# Altium project Gym_rep_counter.PrjPcb
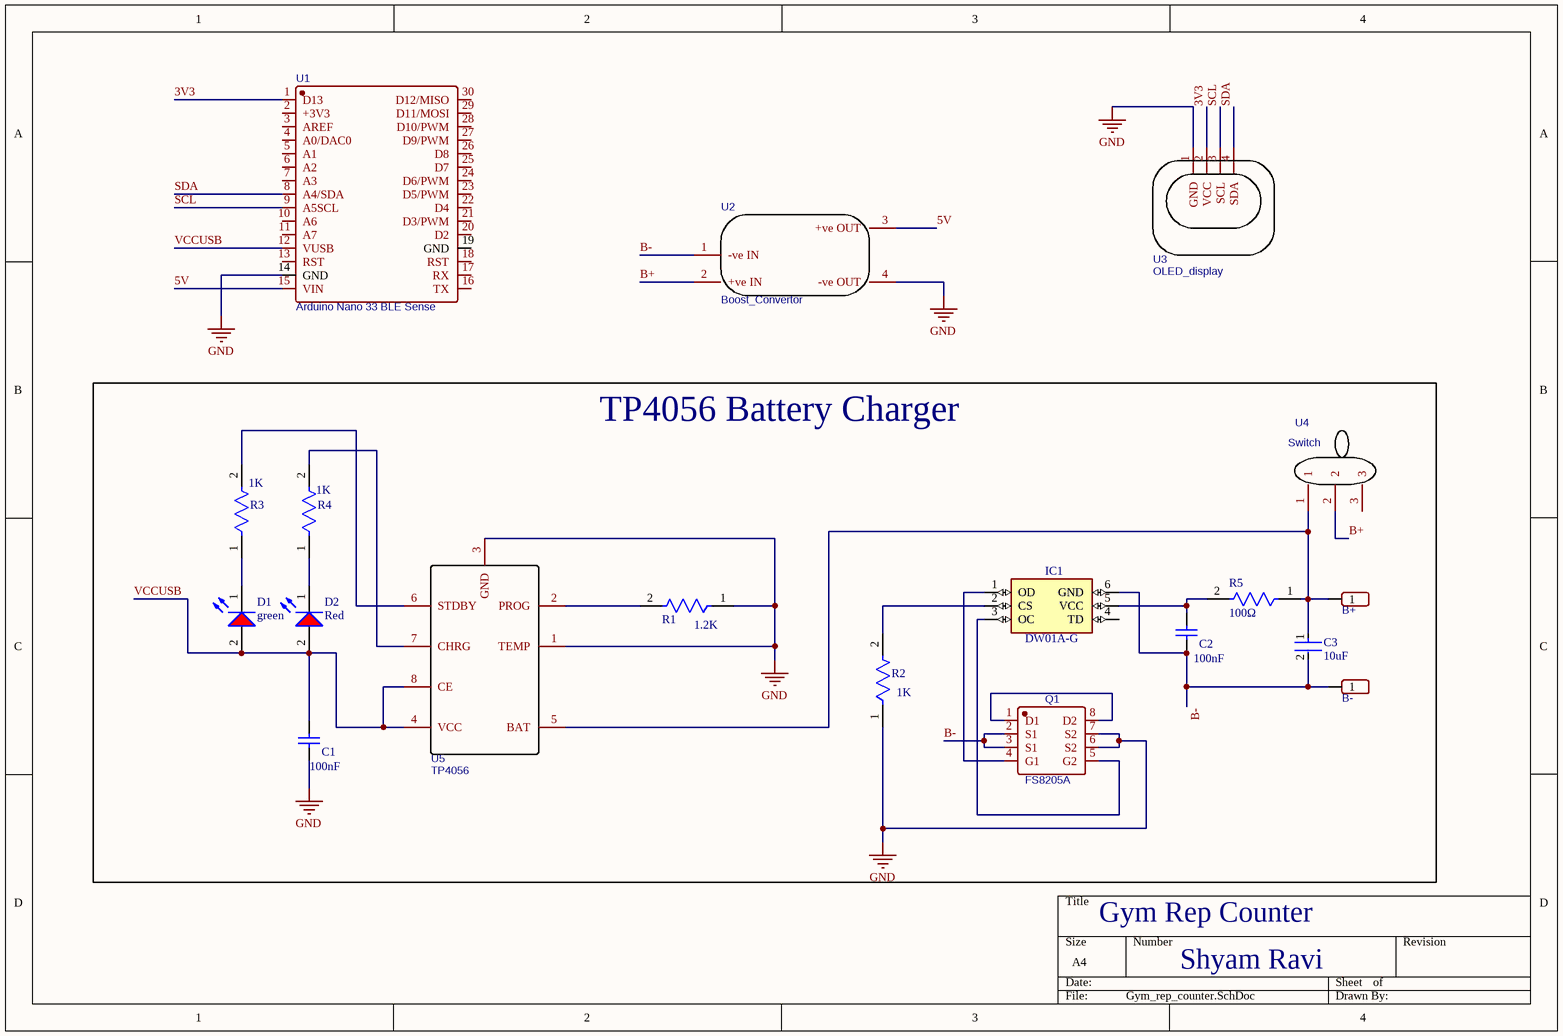
[diagram p0: Gym_rep_counter.SchDoc]
1 sheet, 19 parts. Net scope: global (net labels, ports and power ports of the same name join across sheets).
Board file: Gym_rep_counter.PcbDoc

## Sheet Gym_rep_counter.SchDoc
size A4; SheetNumber: 1; SheetTotal: 1

### Parts
B+  Header-Male-2.54_1x1  [Battery_connector]  (value not drawn)
B-  Header-Male-2.54_1x1  [Battery_connector]  (value not drawn)
C1  100nF  [CAPC2013X88X50LL20T25]
C2  100nF  [CAPC2013X88X50LL20T25]
C3  10uF  [FP-GRM188-0_1-e0_2_0_5-IPC_B]
D1  green  [WL-SMCW_0805_150080xx75000]
D2  Red  [WL-SMCW_0805_150080xx75000]
IC1  DW01A-G  [SOT95P280X135-6N]
Q1  FS8205A  [TSSOP-8_L4.4-W3.5-P0.65-LS6.4-BL]
R1  1.2K  [FP-CRCW0603-HPe3-MFG]
R2  1K  [FP-CRCW0603-HPe3-MFG]
R3  1K  [FP-CRCW0603-HPe3-MFG]
R4  1K  [FP-CRCW0603-HPe3-MFG]
R5  100Ω  [FP-CRCW0603-HPe3-MFG]
U1  Arduino Nano 33 BLE Sense  [arduino_nano_33]
U2  Boost_Convertor  [BOOST_CONVERTER]
U3  OLED_display  [OLED_DISPLAY]
U4  Switch  [SWITCH]
U5  TP4056  [TP4056]

### Blocks framed on the sheet
TP4056 Battery Charger: B+ B- C1-C3 D1 D2 IC1 Q1 R1-R5 U4 U5

### Nets
GND: C1.1 Q1.6(S2) Q1.7(S2) R1.1 R2.1 U1.14(GND) U2.4(-ve_OUT) U3.1(GND) U5.1(TEMP) U5.3(GND)
3V3: U1.1(D13) U3.2(VCC)
5V: U1.15(VIN) U2.3(+ve_OUT)
B+: U2.2(+ve_IN) U4.2
B-: B-.1 C2.1 C3.2 IC1.6(GND) Q1.2(S1) Q1.3(S1) U2.1(-ve_IN)
SCL: U1.9(A5SCL) U3.3(SCL)
SDA: U1.8(A4/SDA) U3.4(SDA)
VCCUSB: C1.2 D1.2(A) D2.2(A) U1.12(VUSB) U5.4(VCC) U5.8(CE)
NetB+_1: B+.1 C3.1 R5.1 U4.1 U5.5(BAT)
NetC2_2: C2.2 IC1.5(VCC) R5.2
NetD1_1: D1.1(K) R3.1
NetD2_1: D2.1(K) R4.1
NetIC1_1: IC1.1(OD) Q1.4(G1)
NetIC1_2: IC1.2(CS) R2.2
NetIC1_3: IC1.3(OC) Q1.5(G2)
NetQ1_1: Q1.1(D1) Q1.8(D2)
NetR1_2: R1.2 U5.2(PROG)
NetR3_2: R3.2 U5.6(STDBY)
NetR4_2: R4.2 U5.7(CHRG)

Not connected (* = marked no-connect by the designer): IC1 4(TD); U1 2(+3V3) 3(AREF) 4(A0/DAC0) 5(A1) 6(A2) 7(A3) 10(A6) 11(A7) 13(RST) 16(TX) 17(RX) 18(RST) 19(GND) 20(D2) 21(D3/PWM) 22(D4) 23(D5/PWM) 24(D6/PWM) 25(D7) 26(D8) 27(D9/PWM) 28(D10/PWM) 29(D11/MOSI) 30(D12/MISO); U4 3

### Notes on the sheet
- Gym Rep Counter
- Shyam Ravi

### Library data of the parts
B+ B- = Battery_Connector: Manufacturer: ReliaPro; Supplier Part: C81276; Supplier: LCSC; Manufacturer Part: Header-Male-2.54_1x1; spicePre: P
C1 C2 = CMP-2007-00266-1: Manufacturer: Kemet; Part Number: C0805C103K5RACTU
C3 = CMP-2006-02860-2: Chip Multilayer Ceramic Capacitors for General Purpose, 0603, 0.47uF, X7R, 15%, 10%, 16V; Capacitance: 470nF; Material: Ceramic; Termination: SMD/SMT; Case Code (Imperial): 0603; Height: 0.8mm; Dielectric: X7R; Length: 1.6mm; Packaging: Tape and Reel; Mount: Surface Mount; Thickness: 0.035inch; Voltage Rating (DC): 16V; Case Code (Metric): 1608; REACH SVHC: No SVHC; Depth: 0.8mm; Number of Pins: 2; Max Operating Temperature: 125°C; Min Operating Temperature: -55°C; Width: 0.8mm; Voltage: 16V; Lead Free: Lead Free; Voltage Rating: 16V; Package Quantity: 1; Case/Package: 0603; Tolerance: 10%
D1 D2 = CMP-1426-00011-3: LED Uni-Color Red 630nm 2-Pin Chip 0805(2012Metric) T/R; Viewing Angle: 140°; Max Junction Temperature (Tj): 95°C; Power Dissipation: 72mW; Forward Current: 100mA; Forward Voltage: 2V; Wavelength: 625nm; Test Current: 20mA; Max Reverse Voltage (DC): 5V; Luminous Intensity: 150mcd; Lens Style: Clear, Rectangular; REACH SVHC: Unknown; Height: 700µm; Case Code (Metric): 2012; Peak Wavelength: 630nm; Length: 2mm; Width: 1.25mm; RoHS: Compliant; Packaging: Tape and Reel; Dominant Wavelength: 625nm; Color: Red; Case Code (Imperial): 0805; Min Operating Temperature: -40°C; Mount: Surface Mount; Max Operating Temperature: 85°C; Case/Package: 0805
IC1 = DW01A-G: One Cell Lithium-ion/Polymer Battery Protection IC; MF: Fortune; SnapEDA_Link: https://www.snapeda.com/parts/DW01A-G/Fortune+Semiconductor/view-part/?ref=snap; Package: None; Value: *; MP: DW01A-G; Check_prices: https://www.snapeda.com/parts/DW01A-G/Fortune+Semiconductor/view-part/?ref=eda
Q1 = FS8205A: Manufacturer: FORTUNE; SMT Type: Basic; Supplier: LCSC; Manufacturer Part: FS8205A; LCSC Assembly: Yes; image: //image.lceda.cn/szlcsc/C16052.jpg; Supplier Part: C16052; spicePre: Q; spiceSymbolName: FS8205A
R1-R5 = CMP-2000-02970-2: RES Thick Film, 1kΩ, 1%, 0.33W, 100ppm/°C, 0603; Max Power Dissipation: 250mW; Voltage Rating (DC): 75V; Resistance: 1kR; Number of Terminations: 2; Min Operating Temperature: -55°C; Contact Plating: Tin; Termination: SMD/SMT; Weight: 7.1E-05oz; Height: 0.45mm; Radiation Hardening: No; Package Quantity: 10; Case Code (Imperial): 0603; Packaging: Tape and Reel; Max Operating Temperature: 155°C; Case/Package: 0603; Lead Free: Lead Free; Military Standard: Not; Mount: Surface Mount; Power Rating: 250mW; Length: 1.6mm; Features: Automotive AEC-Q200; Number of Pins: 2; Voltage Rating: 75V; Temperature Coefficient: 100ppm/°C; Depth: 0.85mm; Tolerance: 1%; Composition: Thick Film; Width: 0.8mm; Case Code (Metric): 1608
U1 = arduino_nano_33: Manufacturer Part: Barcode: 7630049201507; Contributor: RedCoal; Manufacturer: Arduino; Supplier: Arduino store; Supplier Part: ABX00031; link: https://store-usa.arduino.cc/products/arduino-nano-33-ble-sense?selectedStore=us; Datasheet: https://docs.arduino.cc/resources/datasheets/ABX00031-datasheet.pdf?_gl=1*1n6zooy*_ga*NzA1NzIyOTE4LjE2MzUzMjI4MjI.*_ga_NEXN8H46L5*MTY0MjgyNzE0Ni40LjEuMTY0MjgyNzE2Ny4w; spicePre: U; spiceSymbolName: Arduino Nano 33 BLE Sense
U2 = Boost_Convertor: Contributor: Shyam Ravi; spicePre: U; spiceSymbolName: Boost_Convertor
U3 = OLED_display: Contributor: shyamganeshravi2003; spicePre: U; spiceSymbolName: OLED_display
U4 = Switch: Contributor: Shyam Ravi; spicePre: U; spiceSymbolName: Switch
U5 = TP4056: Manufacturer: TOPPOWER; Contributor: Guest; Supplier: LCSC; Manufacturer Part: TP4056; LCSC Assembly: Yes; image: //image.lceda.cn/szlcsc/C16581.jpg; Supplier Part: C16581; spicePre: U